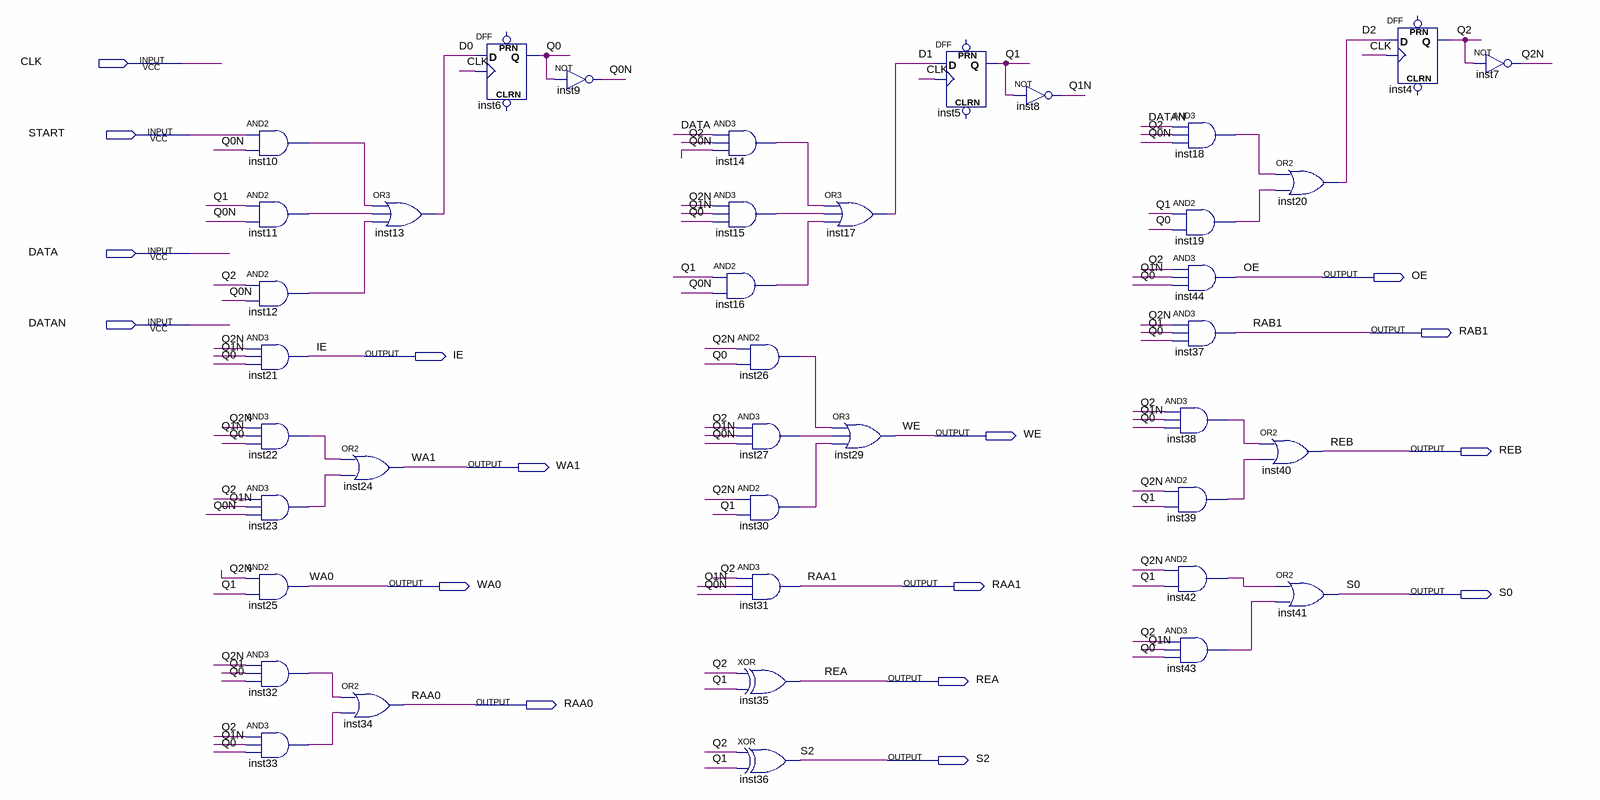
[diagram p0: schematic sheet]
// Quartus schematic CONTROL.bdf as structural Verilog: 40 symbols, 16 pins
module CONTROL (
  input  CLK,
  input  START,
  input  DATA,
  input  DATAN,
  output OE,
  output RAB1,
  output IE,
  output WE,
  output REB,
  output WA1,
  output WA0,
  output RAA1,
  output S0,
  output REA,
  output RAA0,
  output S2
);

  wire D0, D1, D2, inst10_out, inst11_out, inst12_out, inst14_out, inst15_out, inst16_out, inst18_out,
       inst19_out, inst22_out, inst23_out, inst26_out, inst27_out, inst30_out, inst32_out, inst33_out,
       inst38_out, inst39_out, inst42_out, inst43_out, Q0, Q0N, Q1, Q1N, Q2, Q2N;

  and inst10 (inst10_out, START, Q0N);
  and inst11 (inst11_out, Q1, Q0N);
  and inst12 (inst12_out, Q2, Q0N);
  and inst21 (IE, Q2N, Q1N, Q0);
  and inst22 (inst22_out, Q2N, Q1N, Q0);
  and inst23 (inst23_out, Q2, Q1N, Q0N);
  and inst25 (WA0, Q2N, Q1);
  and inst32 (inst32_out, Q2N, Q1, Q0);
  and inst33 (inst33_out, Q2, Q1N, Q0);
  or inst13 (D0, inst10_out, inst11_out, inst12_out);
  or inst24 (WA1, inst22_out, inst23_out);
  or inst34 (RAA0, inst32_out, inst33_out);
  DFF inst6 (.CLK(CLK), .D(D0), .Q(Q0));  // open: CLRN, PRN
  not inst9 (Q0N, Q0);
  and inst14 (inst14_out, DATA, Q2, Q0N);
  and inst15 (inst15_out, Q2N, Q1N, Q0);
  and inst16 (inst16_out, Q1, Q0N);
  and inst26 (inst26_out, Q2N, Q0);
  and inst27 (inst27_out, Q2, Q1N, Q0N);
  and inst30 (inst30_out, Q2N, Q1);
  and inst31 (RAA1, Q2, Q1N, Q0N);
  xor inst35 (REA, Q2, Q1);
  xor inst36 (S2, Q2, Q1);
  or inst17 (D1, inst14_out, inst15_out, inst16_out);
  or inst29 (WE, inst26_out, inst27_out, inst30_out);
  DFF inst5 (.CLK(CLK), .D(D1), .Q(Q1));  // open: CLRN, PRN
  not inst8 (Q1N, Q1);
  and inst18 (inst18_out, DATAN, Q2, Q0N);
  and inst19 (inst19_out, Q1, Q0);
  and inst44 (OE, Q2, Q1N, Q0);
  and inst37 (RAB1, Q2N, Q1, Q0);
  and inst38 (inst38_out, Q2, Q1N, Q0);
  and inst39 (inst39_out, Q2N, Q1);
  and inst42 (inst42_out, Q2N, Q1);
  and inst43 (inst43_out, Q2, Q1N, Q0);
  or inst40 (REB, inst38_out, inst39_out);
  or inst20 (D2, inst18_out, inst19_out);
  or inst41 (S0, inst42_out, inst43_out);
  DFF inst4 (.CLK(CLK), .D(D2), .Q(Q2));  // open: CLRN, PRN
  not inst7 (Q2N, Q2);
endmodule
